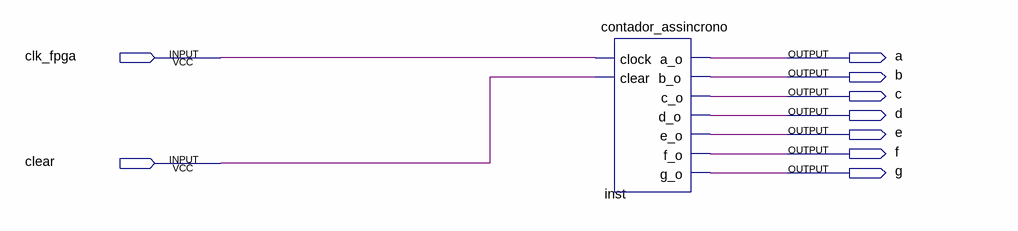
[diagram p0: schematic sheet]
// Quartus schematic counter.bdf as structural Verilog: 1 symbols, 9 pins
module counter (
  input  clk_fpga,
  input  clear,
  output a,
  output b,
  output c,
  output d,
  output e,
  output f,
  output g
);

  contador_assincrono inst (
    .clock(clk_fpga), .clear(clear), .a_o(a), .b_o(b), .c_o(c), .d_o(d), .e_o(e), .f_o(f), .g_o(g));
endmodule
